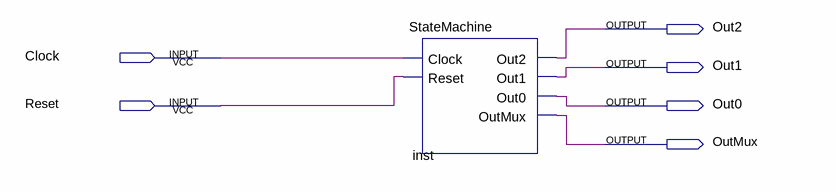
[diagram p0: schematic sheet]
// Quartus schematic testState.bdf as structural Verilog: 1 symbols, 6 pins
module testState (
  input  Clock,
  input  Reset,
  output Out2,
  output Out1,
  output Out0,
  output OutMux
);

  StateMachine inst (.Clock(Clock), .Reset(Reset), .Out2(Out2), .Out1(Out1), .Out0(Out0), .OutMux(OutMux));
endmodule
